# Altium schematic sheet Micro_bp.SchDoc
size A4
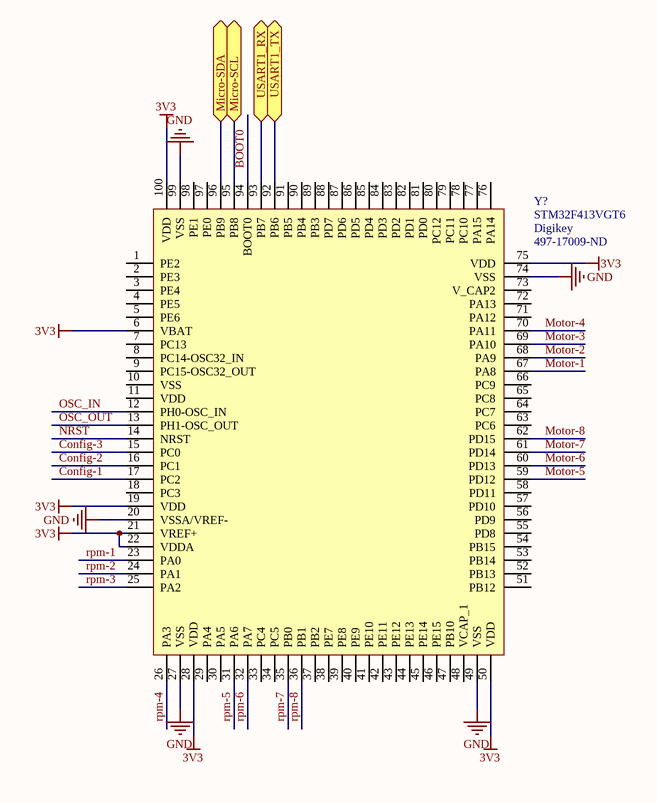
[diagram p0: Micro_bp.SchDoc]

## Parts
Y?  STM32F413VGT6  Supplier: Digikey  Supplier Part Number 1: 497-17009-ND  [STM-LQFP100_M]

## Ports
Micro-SCL, Micro-SDA, USART1_RX, USART1_TX

## Nets
3V3: Y?.6(VBAT) Y?.19(VDD) Y?.21(VREF+) Y?.22(VDDA) Y?.28(VDD) Y?.50(VDD) Y?.75(VDD) Y?.100(VDD)
GND: Y?.20(VSSA/VREF-) Y?.27(VSS) Y?.49(VSS) Y?.74(VSS) Y?.99(VSS)
BOOT0: Y?.94(BOOT0)
Config-1: Y?.17(PC2)
Config-2: Y?.16(PC1)
Config-3: Y?.15(PC0)
Micro-SCL: Y?.95(PB8) ; port Micro-SCL
Micro-SDA: Y?.96(PB9) ; port Micro-SDA
Motor-1: Y?.67(PA8)
Motor-2: Y?.68(PA9)
Motor-3: Y?.69(PA10)
Motor-4: Y?.70(PA11)
Motor-5: Y?.59(PD12)
Motor-6: Y?.60(PD13)
Motor-7: Y?.61(PD14)
Motor-8: Y?.62(PD15)
NRST: Y?.14(NRST)
OSC_IN: Y?.12(PH0-OSC_IN)
OSC_OUT: Y?.13(PH1-OSC_OUT)
rpm-1: Y?.23(PA0)
rpm-2: Y?.24(PA1)
rpm-3: Y?.25(PA2)
rpm-4: Y?.26(PA3)
rpm-5: Y?.31(PA6)
rpm-6: Y?.32(PA7)
rpm-7: Y?.35(PB0)
rpm-8: Y?.36(PB1)
USART1_RX: Y?.93(PB7) ; port USART1_RX
USART1_TX: Y?.92(PB6) ; port USART1_TX

Not connected (* = marked no-connect by the designer): Y? 1(PE2) 2(PE3) 3(PE4) 4(PE5) 5(PE6) 7(PC13) 8(PC14-OSC32_IN) 9(PC15-OSC32_OUT) 10(VSS) 11(VDD) 18(PC3) 29(PA4) 30(PA5) 33(PC4) 34(PC5) 37(PB2) 38(PE7) 39(PE8) 40(PE9) 41(PE10) 42(PE11) 43(PE12) 44(PE13) 45(PE14) 46(PE15) 47(PB10) 48(VCAP_1) 51(PB12) 52(PB13) 53(PB14) 54(PB15) 55(PD8) 56(PD9) 57(PD10) 58(PD11) 63(PC6) 64(PC7) 65(PC8) 66(PC9) 71(PA12) 72(PA13) 73(V_CAP2) 76(PA14) 77(PA15) 78(PC10) 79(PC11) 80(PC12) 81(PD0) 82(PD1) 83(PD2) 84(PD3) 85(PD4) 86(PD5) 87(PD6) 88(PD7) 89(PB3) 90(PB4) 91(PB5) 97(PE0) 98(PE1)

## Library data of the parts
Y? = STM32F413VGT6: ARM Cortex-M4 32-bit MCU, 180 MHz, 320 KB Internal Rap, 81 I/O, 100-pin LQFP, -40 to 85 degC, Tray; Core Size: 32-bit; Supplier 1: Digi-Key